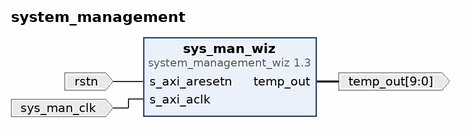
[diagram p0: block diagram of the top level]
# Vivado block design system_management, xczu9eg-ffvb1156-2-e, Vivado 2022.1
create_bd_design system_management

create_bd_port -dir I -type clk sys_man_clk
set_property -dict {CONFIG.FREQ_HZ 125000000} [get_bd_ports sys_man_clk]
create_bd_port -dir I -type rst rstn
create_bd_port -dir O -from 9 -to 0 -type data temp_out

create_bd_cell -type ip -vlnv xilinx.com:ip:system_management_wiz:1.3 sys_man_wiz
set_property -dict [list \
  CONFIG.ADC_CONVERSION_RATE 200 \
  CONFIG.AVERAGE_ENABLE_TEMPERATURE false \
  CONFIG.CHANNEL_ENABLE_VBRAM false \
  CONFIG.CHANNEL_ENABLE_VCCAUX false \
  CONFIG.CHANNEL_ENABLE_VCCINT false \
  CONFIG.CHANNEL_ENABLE_VP_VN false \
  CONFIG.DCLK_FREQUENCY 125 \
  CONFIG.ENABLE_TEMP_BUS true \
  CONFIG.INTERFACE_SELECTION Enable_AXI \
] [get_bd_cells sys_man_wiz]

# ---- connections ----

connect_bd_net [get_bd_ports rstn] [get_bd_pins sys_man_wiz/s_axi_aresetn]
connect_bd_net [get_bd_ports sys_man_clk] [get_bd_pins sys_man_wiz/s_axi_aclk]
connect_bd_net -net system_management_wiz_0_temp_out [get_bd_pins sys_man_wiz/temp_out] [get_bd_ports temp_out]

validate_bd_design
save_bd_design
